# Altium schematic sheet input.SchDoc
size A4; SheetNumber: 1; SheetTotal: 1
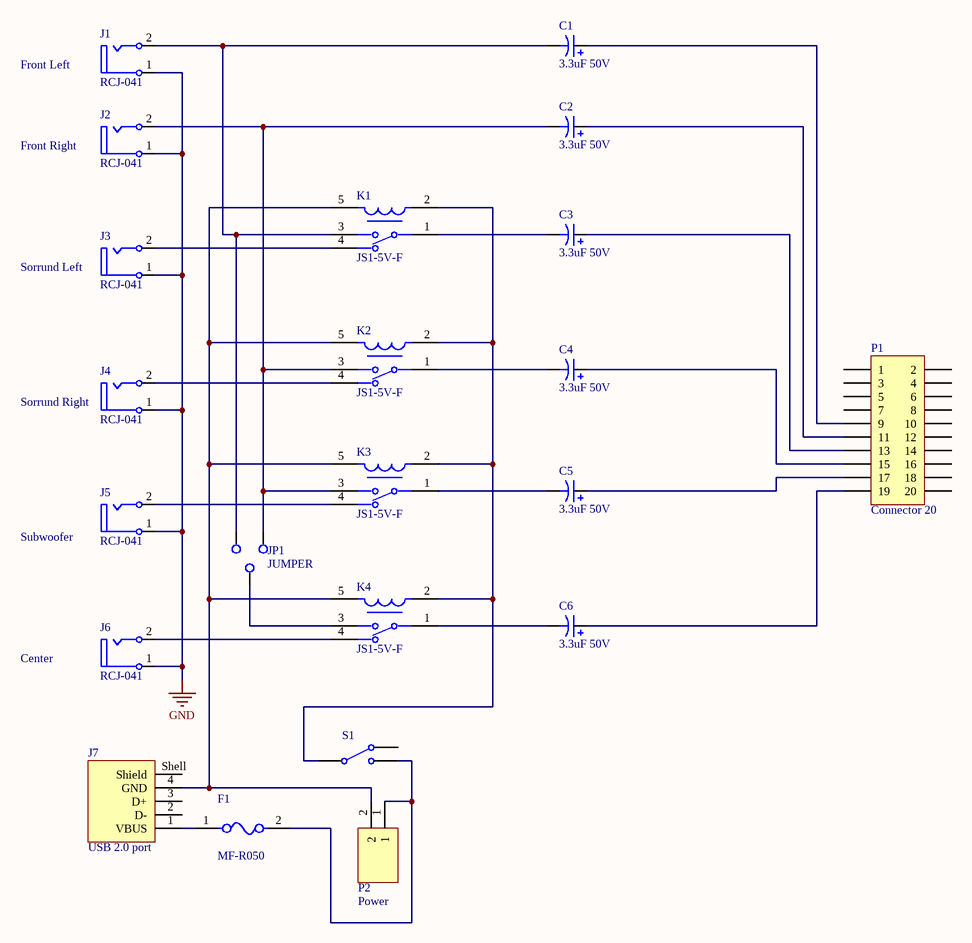
[diagram p0: input.SchDoc]

## Parts
C1  3.3uF 50V  [FP_CAP_ELKO_6,3X6,3]
C2  3.3uF 50V  [FP_CAP_ELKO_6,3X6,3]
C3  3.3uF 50V  [FP_CAP_ELKO_6,3X6,3]
C4  3.3uF 50V  [FP_CAP_ELKO_6,3X6,3]
C5  3.3uF 50V  [FP_CAP_ELKO_6,3X6,3]
C6  3.3uF 50V  [FP_CAP_ELKO_6,3X6,3]
F1  MF-R050  [FP-MF-R050-MFG]
J1  RCJ-041  [CUI-RCJ-041_V]
J2  RCJ-041  [CUI-RCJ-041_V]
J3  RCJ-041  [CUI-RCJ-041_V]
J4  RCJ-041  [CUI-RCJ-041_V]
J5  RCJ-041  [CUI-RCJ-041_V]
J6  RCJ-041  [CUI-RCJ-041_V]
J7  USB 2.0 port  [629104151021]
JP1  JUMPER  [FP_CONN3_TUSKE_254MM]
K1  JS1-5V-F  [FP-JS1-5V-F-MFG]
K2  JS1-5V-F  [FP-JS1-5V-F-MFG]
K3  JS1-5V-F  [FP-JS1-5V-F-MFG]
K4  JS1-5V-F  [FP-JS1-5V-F-MFG]
P1  Connector 20  [CONNECTOR-20P]
P2  Power  [FP_CONN2_TAP_254MM_90]
S1  Single-Pole, Double-Throw Switch  (value not drawn)

## Nets
GND: J1.1 J2.1 J3.1 J4.1 J5.1 J6.1
NetC1_N: C1.N J1.2 JP1.2(C2) K1.3(N.O.)
NetC1_P: C1.P P1.9
NetC2_N: C2.N J2.2 JP1.3(C3) K2.3(N.O.) K3.3(N.O.)
NetC2_P: C2.P P1.11
NetC3_N: C3.N K1.1(COM)
NetC3_P: C3.P P1.13
NetC4_N: C4.N K2.1(COM)
NetC4_P: C4.P P1.15
NetC5_N: C5.N K3.1(COM)
NetC5_P: C5.P P1.17
NetC6_N: C6.N K4.1(COM)
NetC6_P: C6.P P1.19
NetF1_1: F1.1 J7.1(VBUS)
NetF1_2: F1.2 P2.1 S1.2
NetJ3_2: J3.2 K1.4(N.C.)
NetJ4_2: J4.2 K2.4(N.C.)
NetJ5_2: J5.2 K3.4(N.C.)
NetJ6_2: J6.2 K4.4(N.C.)
NetJ7_4: J7.4(GND) K1.5(2_COIL) K2.5(2_COIL) K3.5(2_COIL) K4.5(2_COIL) P2.2
NetJP1_1: JP1.1(C1) K4.3(N.O.)
NetK1_2: K1.2(1_COIL) K2.2(1_COIL) K3.2(1_COIL) K4.2(1_COIL) S1.1

Not connected (* = marked no-connect by the designer): J7 2(D-) 3(D+) Shell(Shield); P1 1 2 3 4 5 6 7 8 10 12 14 16 18 20; S1 3

## Notes on the sheet
- Front Left
- Front Right
- (near J3) Sorrund Left
- (near J4) Sorrund Right
- Subwoofer
- Center

## Library data of the parts
C1-C6 = CAP_ELECT: Polarized Capacitor; Value: 3.3uF 50V
F1 = CMP-07400-000037-1: PTC RESET FUSE 60V 500MA RADIAL; Manufacturer: Bourns; Current Rating: 40A; Trip Time: 4s; Resistance: 0.41-0.77Ω; Value: 0.41-0.77Ω; Description: PTC Resettable Fuse 0.5A(hold) 1A(trip) 60V 40A 0.75W 4s 0.41Ohm Radial 7.9 X 3.1mm Bulk; Trip Current: 1A; Hold Current: 0.5A; Automotive: No; Device Class L1: Circuit Protection; Ambient Temperature Range Low: -40°C; Height: 13.7mm; Category: Fuse; ComponentLink2Description: Datasheet; Device Class L3: unset; Mouser Description: PTC Resettable Fuse 0.5A(hold) 1A(trip) 60V 40A 0.75W 4s 0.41Ohm Radial 7.9 X 3.1mm Bulk; RoHS: TRUE; Temperature Range High: +85°C; Octopart: https://octopart.com/mf-r050-bourns-19418; Temperature Range Low: -40°C; Device Class L2: PTC Resettable Fuses; Package: MF-R050; Manufacturer Part Number: MF-R050; Temperature: -40°C to +85°C; Ambient Temperature Range High: +85°C; ComponentLink2URL: https://upverter.com/datasheet/a1b715b2a3574ae967878e49fe70c2811aecae4b.pdf; Digikey Description: PTC RESET FUSE 60V 500MA RADIAL; Lead Free: Yes; Voltage Rating: 60V
J1-J6 = CMP-1692-00002-1: Female RCJ Jack, 2 Position, Height 11.724 mm, Tail Length 4 mm, RoHS, Bulk; Case\Package: Metal; Connector Type: HDMI; Current Rating: 500 mA; Voltage Rating: 40 V; Length: 16.2 mm; Pins: 19; ComponentLink1URL: http://www.cui.com/; ComponentLink1Description: Manufacturer URL; Packaging: Tape and Reel; Lead Pitch: 0.5 mm; PackageDescription: Female RCJ Jack, 2 Position, Height 11.724 mm, Tail Length 4 mm; RoHSCompliant: true; Min Operating Temperature: -55 degC; Height: 6.1 mm; Contact Material: Copper; REACH SVHC: No SVHC; DatasheetVersion: Rev. B, 02/2012; ComponentLink2Description: Datasheet; Contact Plating: Gold; Colour: Black; Max Operating Temperature: 85 degC; Mount: Surface Mount; Package Quantity: 400; Gender: Female; ComponentLink2URL: http://www.cui.com/product/resource/rcj-04x.pdf; PackageReference: RCJ-041
J7 = CMP-1502-03241-3: NexarPartId: 52645112; USB Standard: USB 2.0; Insulation Resistance: 1GΩ; Current Rating: 1.5A; Number of Contacts: 4; Contact Resistance: 30mΩ; Gender: Receptacle; Operating Supply Voltage: 30V; Mount: Horizontal, Surface Mount; RoHS: Compliant; Max Operating Temperature: 85°C; Min Operating Temperature: -40°C; Contact Plating: Gold; Contact Material: Gold, Nickel; Number of Pins: 4; Packaging: Tape and Reel; Connector Type: USB; Height: 7.2mm; Orientation: Horizontal; Voltage Rating: 30V; Termination: SMD/SMT; Features: Shielded; REACH SVHC: Unknown
JP1 = JUMPER3: Jumper Wire
K1-K4 = CMP-05606-000016-1: RELAY GEN PURPOSE SPDT 10A 5V; Manufacturer: Panasonic; Coil Type: Non-Latching; Number Of Contacts: 1; Standoff Height: 0.3mm; Switching Power: 150W; Coil Power: 360mW; Coil Current: 72mA; Coil Resistance: 69.4Ω; Lead Free: Yes; Device Class L3: Power Relays; Device Class L1: Electromechanical; Ambient Temperature Range High: +70°C; Temperature: -40°C to +70°C; Temperature Range High: +70°C; Temperature Range Low: -40°C; Manufacturer Part Number: JS1-5V-F; Coil Voltage: 5V; Switching Current: 10A; Digikey Description: RELAY GEN PURPOSE SPDT 10A 5V; Device Class L2: Relays; Ambient Temperature Range Low: -40°C; Throw Configuration: SPDT; Category: Relay; ComponentLink2URL: https://www3.panasonic.biz/ac/e_download/control/relay/power/catalog/mech_eng_js.pdf?via=ok; Package: JS1-5V-F; Octopart: https://octopart.com/js1-5v-f-panasonic-39428621; Mouser Description: JS Series 10 A SPDT 5 V Through Hole Sealed Miniature Non-Polarized Power Relay; Height: 16.8mm; ComponentLink2Description: Datasheet; RoHS: TRUE; Automotive: No
P1 = Connector 20: Ribbon cable connector; Reference: *; Supplier: *; Name: *
P2 = Connector_2pin: 2pin connector
S1 = SPDT SW: nodeUP_closed: 1; Rclosed: 1m; Ropen: 1Meg; SimulationGenericComponent: True